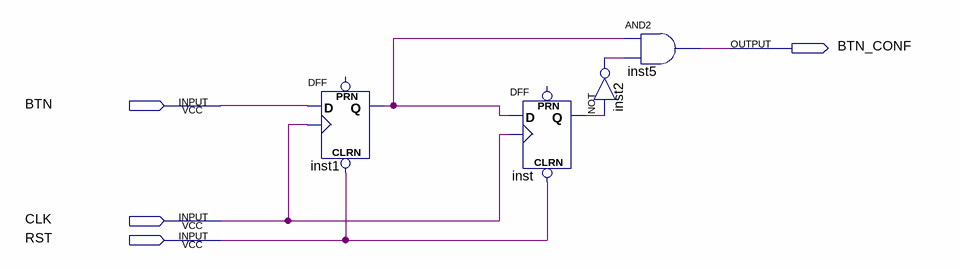
[diagram p0: schematic sheet]
// Quartus schematic Conformador.bdf as structural Verilog: 4 symbols, 4 pins
module Conformador (
  input  BTN,
  input  CLK,
  input  RST,
  output BTN_CONF
);

  wire inst1_q, inst2_out, inst_q;

  DFF inst1 (.CLRN(RST), .CLK(CLK), .D(BTN), .Q(inst1_q));  // open: PRN
  DFF inst (.CLRN(RST), .CLK(CLK), .D(inst1_q), .Q(inst_q));  // open: PRN
  not inst2 (inst2_out, inst_q);
  and inst5 (BTN_CONF, inst1_q, inst2_out);
endmodule
